# EasyEDA schematic OPAMP.json
TITLE: Sheet_1; REV: 1.0; Date: 2022-07-28; Sheet: 1/1; Company: Your Company
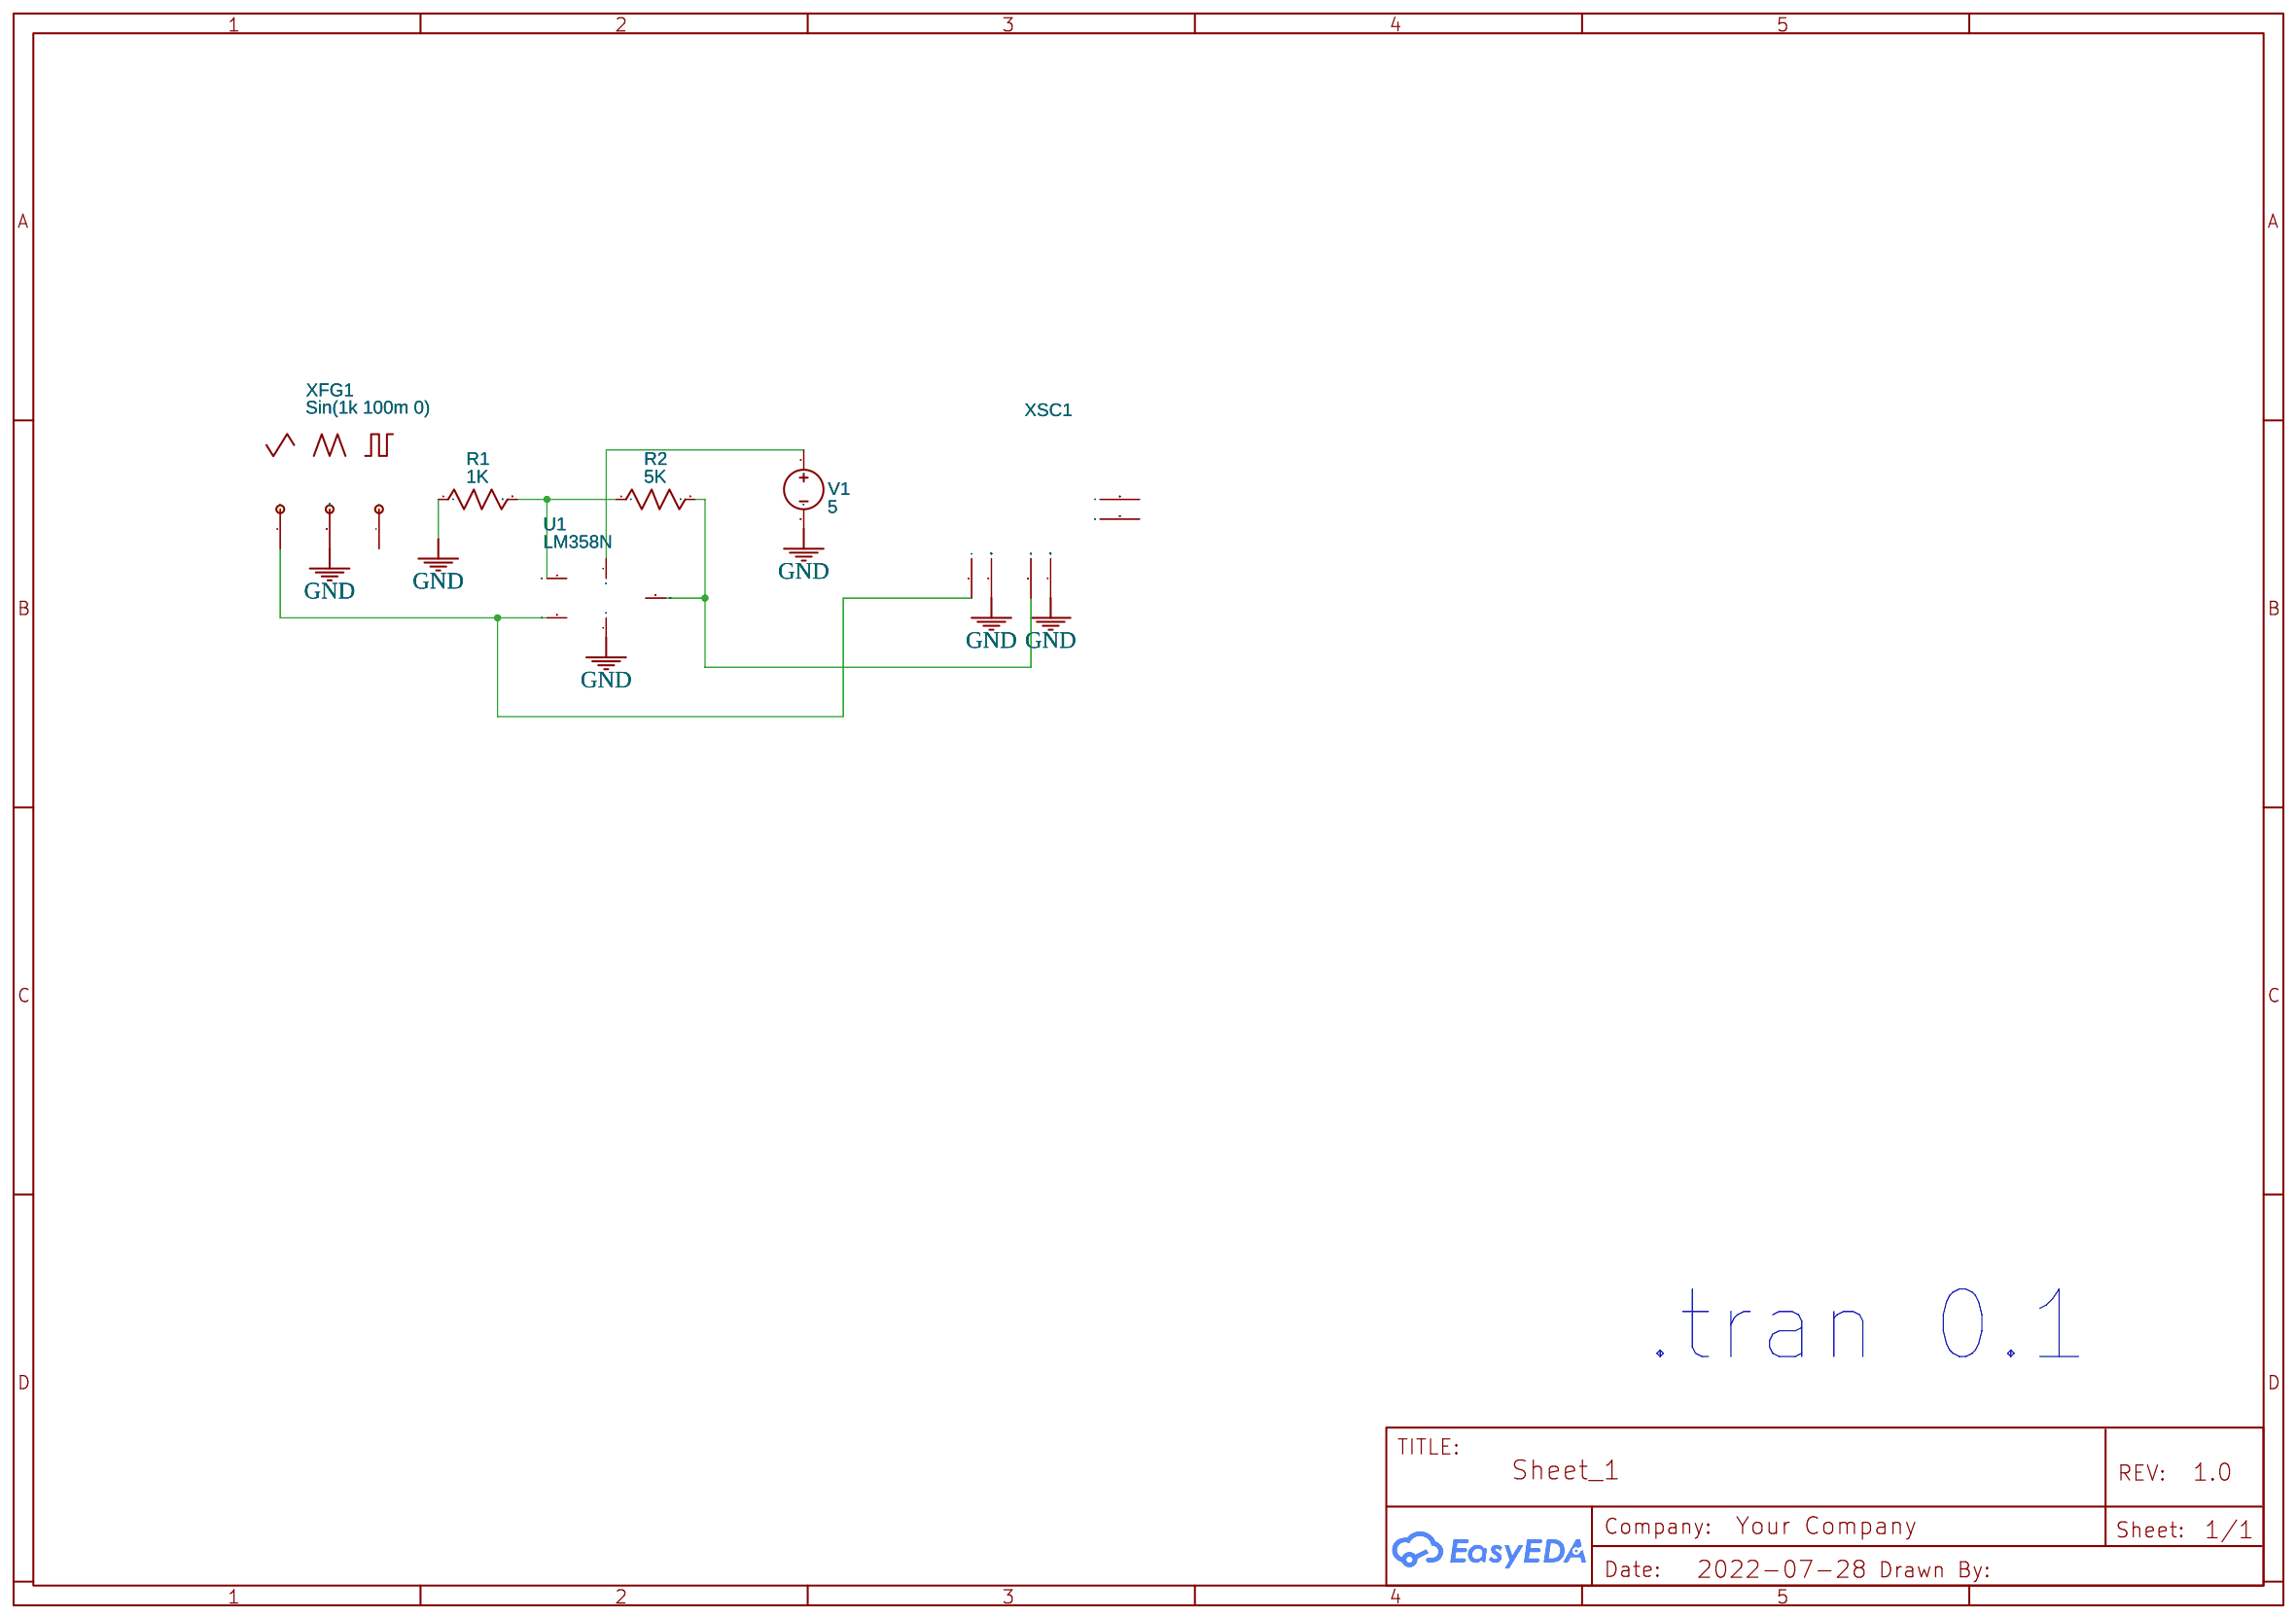
[diagram p0: schematic sheet]

## Parts
R1  1K  [AXIAL-0.3]
R2  5K  [AXIAL-0.3]
U1  LM358N  [?]
V1  5  [HDR1X2]
XFG1  Sin(1k 100m 0)
XSC1  Oscilloscope

## Library data of the parts
R1 R2 = Resistor_US: Resistance: 1k; Contributor: EasyEDA; Supplier: YUJING
U1 = LM358N: Contributor: EasyEDA
V1 = VDC: Contributor: EasyEDA; sim: true
XFG1 = FUNCTIONGENERATOR: Supplier: LCSC; Waveforms: Sine Wave; Frequency: 1k; Duty cycle: 50; Amplitude: 100m; Offset: 0; Rise/Fall Time: 10; NameDisplay: 1; Contributor: EasyEDA; sim: true
XSC1 = OSCILLOSCOPE: Contributor: EasyEDA; NameDisplay: 0; sim: true

## Nets
GND: R1.1 U1.4(V-) V1.2 XFG1.COM XSC1.2(GND1) XSC1.4(GND2)
Net-(R1-2): R1.2 R2.1 U1.2(IN-)
Net-(R2-2): R2.2 U1.6(OUT) XSC1.3(B)
Net-(U1-3): U1.3(IN+) XFG1.+ XSC1.1(A)
Net-(U1-7): U1.7(V+) V1.1

Not connected (* = marked no-connect by the designer): XFG1 -; XSC1 5(T+) 6(T-)

## Notes on the sheet
- .tran 0.1
